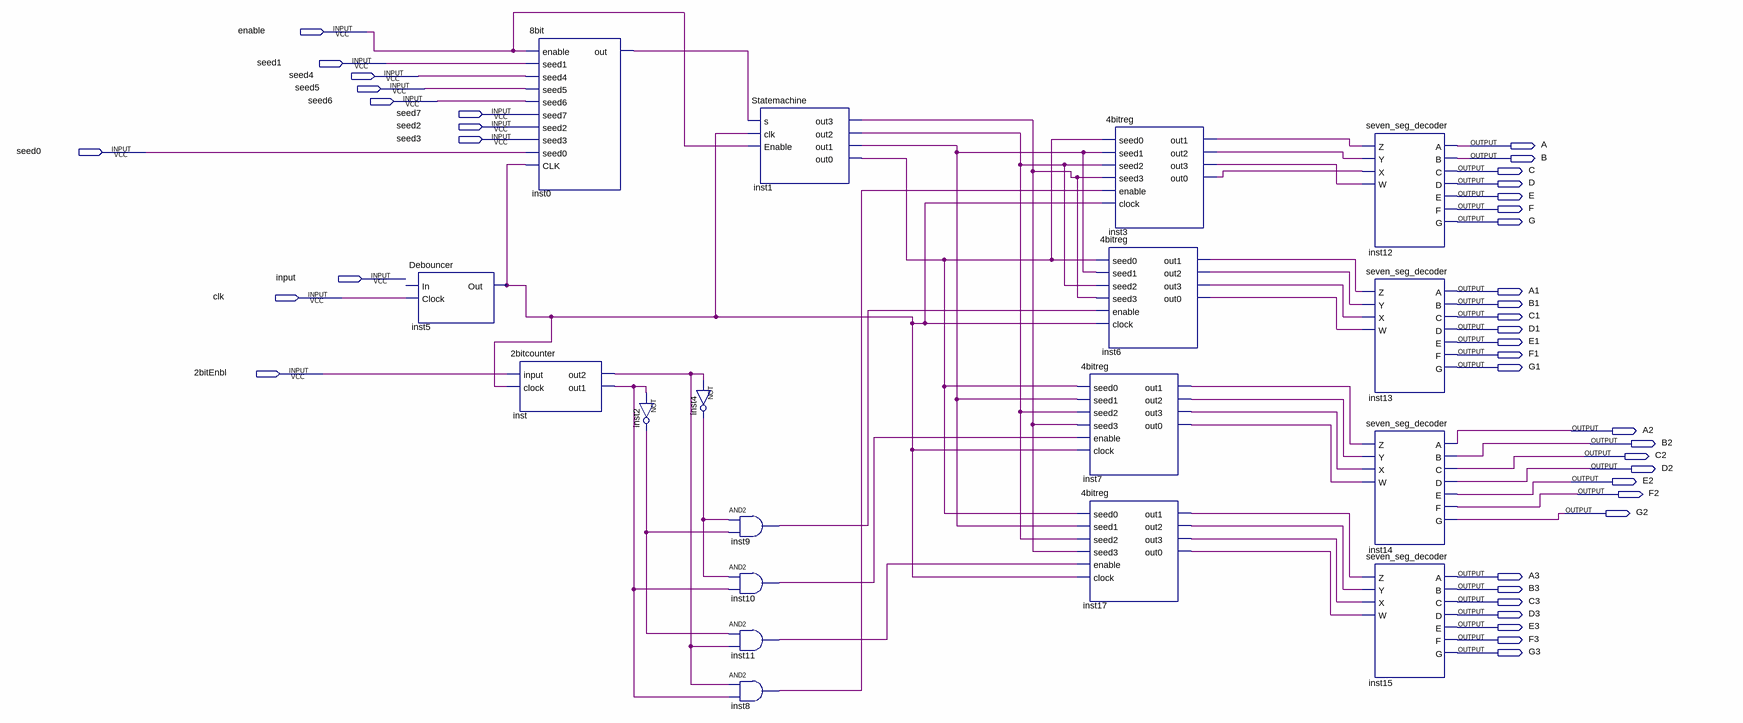
[diagram p0: schematic sheet]
// Quartus schematic psudo.bdf as structural Verilog: 18 symbols, 40 pins
module psudo (
  input  enable,
  input  seed1,
  input  seed4,
  input  seed5,
  input  seed6,
  input  seed7,
  input  seed2,
  input  seed3,
  input  seed0,
  input  \input ,
  input  clk,
  input  \2bitEnbl ,
  output A,
  output B,
  output C,
  output D,
  output E,
  output F,
  output G,
  output A1,
  output B1,
  output C1,
  output D1,
  output E1,
  output F1,
  output G1,
  output A2,
  output B2,
  output C2,
  output D2,
  output E2,
  output F2,
  output G2,
  output A3,
  output B3,
  output C3,
  output D3,
  output E3,
  output F3,
  output G3
);

  wire inst0_out, inst1_out0, inst1_out1, inst1_out2, inst1_out3, inst2_out, inst3_out0, inst3_out1,
       inst3_out2, inst3_out3, inst4_out, inst5_out, inst6_out0, inst6_out1, inst6_out2, inst6_out3,
       inst7_out0, inst7_out1, inst7_out2, inst7_out3, inst8_out, inst9_out, inst10_out, inst11_out,
       inst17_out0, inst17_out1, inst17_out2, inst17_out3, inst_out1, inst_out2;

  Debouncer inst5 (.Clock(clk), .Out(inst5_out));  // open: In
  \2bitcounter  inst (.\input (\2bitEnbl ), .clock(inst5_out), .out2(inst_out2), .out1(inst_out1));
  \8bit  inst0 (
    .enable(enable), .seed1(seed1), .seed4(seed4), .seed5(seed5), .seed6(seed6), .seed7(seed7),
    .seed2(seed2), .seed3(seed3), .seed0(seed0), .CLK(inst5_out), .out(inst0_out));
  not inst2 (inst2_out, inst_out1);
  not inst4 (inst4_out, inst_out2);
  Statemachine inst1 (
    .s(inst0_out), .clk(inst5_out), .Enable(enable), .out3(inst1_out3), .out2(inst1_out2), .out1(inst1_out1),
    .out0(inst1_out0));
  and inst9 (inst9_out, inst4_out, inst2_out);
  and inst10 (inst10_out, inst4_out, inst_out1);
  and inst11 (inst11_out, inst2_out, inst_out2);
  and inst8 (inst8_out, inst_out2, inst_out1);
  \4bitreg  inst3 (
    .seed0(inst1_out0), .seed1(inst1_out1), .seed2(inst1_out2), .seed3(inst1_out3), .enable(inst8_out),
    .clock(inst5_out), .out1(inst3_out1), .out2(inst3_out2), .out3(inst3_out3), .out0(inst3_out0));
  \4bitreg  inst6 (
    .seed0(inst1_out0), .seed1(inst1_out1), .seed2(inst1_out2), .seed3(inst1_out3), .enable(inst9_out),
    .clock(inst5_out), .out1(inst6_out1), .out2(inst6_out2), .out3(inst6_out3), .out0(inst6_out0));
  \4bitreg  inst7 (
    .seed0(inst1_out0), .seed1(inst1_out1), .seed2(inst1_out2), .seed3(inst1_out3), .enable(inst10_out),
    .clock(inst5_out), .out1(inst7_out1), .out2(inst7_out2), .out3(inst7_out3), .out0(inst7_out0));
  \4bitreg  inst17 (
    .seed0(inst1_out0), .seed1(inst1_out1), .seed2(inst1_out2), .seed3(inst1_out3), .enable(inst11_out),
    .clock(inst5_out), .out1(inst17_out1), .out2(inst17_out2), .out3(inst17_out3), .out0(inst17_out0));
  seven_seg_decoder inst12 (
    .Z(inst3_out1), .Y(inst3_out2), .X(inst3_out0), .W(inst3_out3), .A(A), .B(B), .C(C), .D(D), .E(E), .F(F),
    .G(G));
  seven_seg_decoder inst13 (
    .Z(inst6_out1), .Y(inst6_out2), .X(inst6_out3), .W(inst6_out0), .A(A1), .B(B1), .C(C1), .D(D1), .E(E1),
    .F(F1), .G(G1));
  seven_seg_decoder inst14 (
    .Z(inst7_out1), .Y(inst7_out2), .X(inst7_out3), .W(inst7_out0), .A(A2), .B(B2), .C(C2), .D(D2), .E(E2),
    .F(F2), .G(G2));
  seven_seg_decoder inst15 (
    .Z(inst17_out1), .Y(inst17_out2), .X(inst17_out3), .W(inst17_out0), .A(A3), .B(B3), .C(C3), .D(D3),
    .E(E3), .F(F3), .G(G3));
endmodule
